# Altium schematic sheet Control.SchDoc: Motor Driver Control
size A4; SheetNumber: 4; SheetTotal: 4
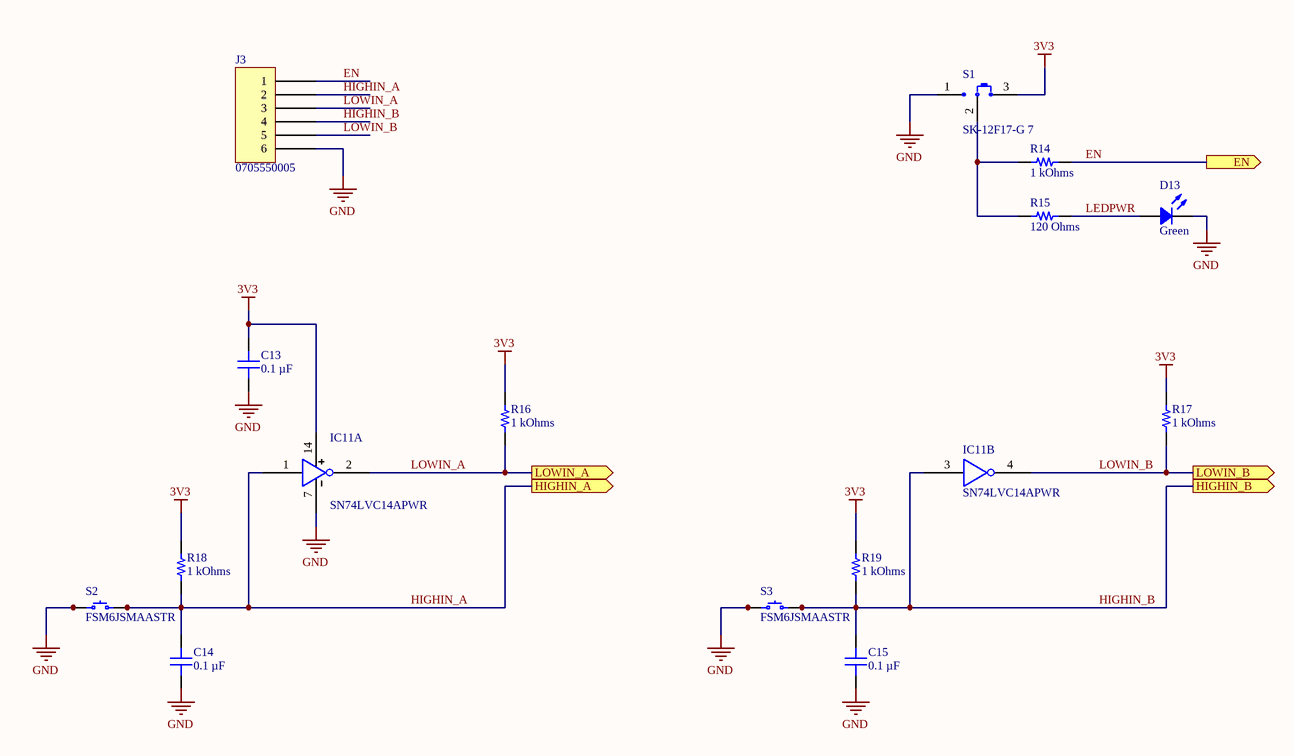
[diagram p0: Control.SchDoc]

## Parts
C13  0.1 µF  [CAP 0603_1608]
C14  0.1 µF  [CAP 0603_1608]
C15  0.1 µF  [CAP 0603_1608]
D13  Green  [LED 0603_1608 GREEN]
IC11  SN74LVC14APWR  [TI TSSOP-14 PW]  (parts A,B of 6)
J3  0705550005  [MOLEX SDA-70555-6PIN]
R14  1 kOhms  [RES 0603_1608]
R15  120 Ohms  [RES 0603_1608]
R16  1 kOhms  [RES 0603_1608]
R17  1 kOhms  [RES 0603_1608]
R18  1 kOhms  [RES 0603_1608]
R19  1 kOhms  [RES 0603_1608]
S1  SK-12F17-G 7  [C&K SK-12F17-G 7]
S2  FSM6JSMAASTR  [TE FSM6JSMA]
S3  FSM6JSMAASTR  [TE FSM6JSMA]

## Ports
EN (out), HIGHIN_A (out), HIGHIN_B (out), LOWIN_A (out), LOWIN_B (out)

## Nets
3V3: C13.2 IC11.14(VCC) R16.2 R17.2 R18.2 R19.2 S1.3
GND: C13.1 C14.1 C15.1 D13.2 IC11.7(GND) J3.6 S1.1 S2.1 S2.2 S3.1 S3.2
EN: J3.1 R14.2 ; port EN
HIGHIN_A: C14.2 IC11.1(1A) J3.2 R18.1 S2.3 S2.4 ; port HIGHIN_A
HIGHIN_B: C15.2 IC11.3(2A) J3.4 R19.1 S3.3 S3.4 ; port HIGHIN_B
LEDPWR: D13.1 R15.2
LOWIN_A: IC11.2(1Y) J3.3 R16.1 ; port LOWIN_A
LOWIN_B: IC11.4(2Y) J3.5 R17.1 ; port LOWIN_B
NetR14_1: R14.1 R15.1 S1.2(COM)

## Notes on the sheet
- Title
- Size:
- Date:
- A4
- Number:
- Time:
- Revision:
- Sheet
- of
- File:

## Library data of the parts
C13-C15 = C0603C104K8RAC7867: CAP CER 0.1UF 10V X7R 0603; manufacturer: KEMET; Tolerance: ±10%; Part Number: C0603C104K8RAC7867; Value: 0.1 µF; Applications: Bypass, Decoupling; Capacitance: 0.1 µF; componentlink1description: Datasheet; componentlink1url: https://api.kemet.com/component-edge/download/datasheet/C0603C104K8RACTU.pdf; componentlink2description: DigiKey Link; componentlink2url: https://www.digikey.com/en/products/detail/kemet/C0603C104K8RAC7867/411094; Device Package: 0603 (1608 Metric); lastupdated: 05/03/2022 16:47:38; Lifecycle Status: Active; Minimum Order: 1; Mounting Type: Surface Mount, MLCC; Operating Temperature: -55°C ~ 125°C; Package / Case: 0603 (1608 Metric); packaging: TapeAndReel; partid: 35650; Part Status: Active; price: 0.01; series: SMD Comm X7R; Size / Dimension: 0.063" L x 0.031" W (1.60mm x 0.80mm); Supplier 1: DigiKey; Supplier Part Number 1: 399-C0603C104K8RAC7867CT-ND; Temperature Coefficient: X7R; Thickness (Max): 0.034" (0.87mm); Voltage - Rated: 10V
D13 = XZMG53W-1: LED GREEN CLEAR CHIP SMD; Manufacturer: SunLED; Configuration: Standard; Current - Test: 20mA; Lens Color: Colorless; Lens Size: 1.10mm x 0.80mm; Lens Style: Rectangle with Flat Top; Millicandela Rating: 11mcd; Viewing Angle: 120°; Voltage - Forward (Vf) (Typ): 2.2V; Wavelength - Dominant: 568nm; Wavelength - Peak: 565nm; Part Number: XZMG53W-1; Color: Green; ComponentLink1Description: Datasheet; ComponentLink1URL: https://www.sunledusa.com/products/spec/XZMG53W-1.pdf; ComponentLink2Description: DigiKey Link; ComponentLink2URL: https://www.digikey.com/en/products/detail/sunled/XZMG53W-1/4745960; Device Package: 0603 (1608 Metric); Height (Max): 0.75mm; LastUpdated: 04/03/2022 18:10:12; Lens Transparency: Clear; Lifecycle Status: Active; Minimum Order: 1; Mounting Type: Surface Mount; Package / Case: 0603 (1608 Metric); Packaging: TapeAndReel; PartId: 678; Part Status: Active; Price: 0.04; Series: -; Size / Dimension: 1.60mm L x 0.80mm W; Supplier 1: DigiKey; Supplier Part Number 1: 1497-1186-1-ND; Supplier Device Package: Chip LED; Value: Green
IC11 = SN74LVC14APWR: IC INVERTER 6CH 6-INP 14TSSOP; Manufacturer: Texas Instruments; Current - Output High, Low: 24mA, 24mA; Current - Quiescent (Max): 1 µA; Logic Level - High: 1.3V ~ 2V; Logic Level - Low: 0.15V ~ 0.8V; Max Propagation Delay @ V, Max CL: 6.2ns @ 3.3V, 50pF; Number of Circuits: 6; Voltage - Supply: 1.65V ~ 3.6V; Part Number: SN74LVC14APWR; ComponentLink1Description: Datasheet; ComponentLink1URL: http://www.ti.com/general/docs/suppproductinfo.tsp?distId=10&gotoUrl=http%3A%2F%2Fwww.ti.com%2Flit%2Fgpn%2Fsn74lvc14a; ComponentLink2Description: DigiKey Link; ComponentLink2URL: https://www.digikey.com/en/products/detail/texas-instruments/SN74LVC14APWR/276867; Features: Schmitt Trigger; LastUpdated: 05/03/2022 19:21:42; Lifecycle Status: Active; Logic Type: Inverter; Minimum Order: 1; Mounting Type: Surface Mount; Number of Inputs: 6; Operating Temperature: -40°C ~ 125°C; Package / Case: 14-TSSOP (0.173", 4.40mm Width); Packaging: TapeAndReel; PartId: 14; Part Status: Active; Price: 0.11; Series: 74LVC; Supplier 1: DigiKey; Supplier Part Number 1: 296-1224-1-ND; Supplier Device Package: 14-TSSOP
J3 = 0705550005: CONN HEADER R/A 6POS 2.54MM; Manufacturer: Molex; Contact Length - Mating: 0.240" (6.10mm); Contact Length - Post: 0.130" (3.30mm); Material Flammability Rating: UL94 V-0; Number of Positions: 6; Number of Positions Loaded: All; Pitch - Mating: 0.100" (2.54mm); Shrouding: Shrouded - 4 Wall; Style: Board to Cable/Wire; Voltage Rating: 250V; Part Number: 0705550005; ComponentLink1Description: Datasheet; ComponentLink1URL: https://www.molex.com/pdm_docs/sd/705550001_sd.pdf; ComponentLink2Description: DigiKey Link; ComponentLink2URL: http://digikey.com/product-detail/en/molex/0705550005/23-0705550005-ND/1643402; Connector Type: Header; Contact Finish - Mating: Tin; Contact Finish - Post: Tin; Contact Finish Thickness - Mating: 150.0µin (3.81µm); Contact Material: Phosphor Bronze; Contact Shape: Square; Contact Type: Male Pin; Fastening Type: Latch Holder; Features: Board Guide; Insulation Color: Black; Insulation Height: 0.215" (5.45mm); Insulation Material: Polyester, Glass Filled; LastUpdated: 13/01/2020 00:04:40; Lifecycle Status: Active; Minimum Order: 1; Mounting Type: Through Hole, Right Angle; Number of Rows: 1; Operating Temperature: -40°C ~ 105°C; Packaging: Tube; PartId: 102; Part Status: Active; Price: 1.19; Series: SL 70555; Supplier 1: DigiKey; Supplier Part Number 1: 23-0705550005-ND; Termination: Solder
R14 R16-R19 = ERJ-PA3J102V: RES SMD 1K OHM 5% 1/4W 0603; Manufacturer: Panasonic Electronic Components; Power (Watts): 0.25W, 1/4W; Temperature Coefficient: ±200ppm/°C; Part Number: ERJ-PA3J102V; Value: 1 kOhms; ComponentLink1Description: Datasheet; ComponentLink1URL: https://industrial.panasonic.com/cdbs/www-data/pdf/RDO0000/AOA0000C331.pdf; ComponentLink2Description: DigiKey Link; ComponentLink2URL: https://www.digikey.com/en/products/detail/panasonic-electronic-components/ERJ-PA3J102V/5035970; Composition: Thick Film; Device Package: 0603 (1608 Metric); Features: Automotive AEC-Q200, Pulse Withstanding; Height - Seated (Max): 0.022" (0.55mm); LastUpdated: 05/03/2022 17:04:10; Lifecycle Status: Active; Minimum Order: 1; Number of Terminations: 2; Operating Temperature: -55°C ~ 155°C; Package / Case: 0603 (1608 Metric); Packaging: TapeAndReel; PartId: 17507; Part Status: Active; Price: 0.01; Ratings: AEC-Q200; Resistance: 1 kOhms; Series: ERJ-PA3; Size / Dimension: 0.063" L x 0.031" W (1.60mm x 0.80mm); Supplier 1: DigiKey; Supplier Part Number 1: P1KBZCT-ND; Supplier Device Package: 0603; Tolerance: ±5%
R15 = ERJ-PA3J121V: RES SMD 120 OHM 5% 1/4W 0603; Manufacturer: Panasonic Electronic Components; Power (Watts): 0.25W, 1/4W; Temperature Coefficient: ±200ppm/°C; Part Number: ERJ-PA3J121V; Value: 120 Ohms; ComponentLink1Description: Datasheet; ComponentLink1URL: https://industrial.panasonic.com/cdbs/www-data/pdf/RDO0000/AOA0000C331.pdf; ComponentLink2Description: DigiKey Link; ComponentLink2URL: https://www.digikey.com/en/products/detail/panasonic-electronic-components/ERJ-PA3J121V/5035980; Composition: Thick Film; Device Package: 0603 (1608 Metric); Features: Automotive AEC-Q200, Pulse Withstanding; Height - Seated (Max): 0.022" (0.55mm); LastUpdated: 05/03/2022 17:04:36; Lifecycle Status: Active; Minimum Order: 1; Number of Terminations: 2; Operating Temperature: -55°C ~ 155°C; Package / Case: 0603 (1608 Metric); Packaging: TapeAndReel; PartId: 8933; Part Status: Active; Price: 0.01; Ratings: AEC-Q200; Resistance: 120 Ohms; Series: ERJ-PA3; Size / Dimension: 0.063" L x 0.031" W (1.60mm x 0.80mm); Supplier 1: DigiKey; Supplier Part Number 1: P120BZCT-ND; Supplier Device Package: 0603; Tolerance: ±5%
S1 = SK-12F17-G 7: SWITCH SLIDE SPDT 300MA 30V; Manufacturer: C&K; Actuator Length: 7.00mm; Actuator Type: Standard; Contact Timing: Not Specified; Current Rating (Amps): 300mA (DC); Switch Function: On-On; Part Number: SK-12F17-G 7; Circuit: SPDT; ComponentLink1Description: Datasheet; ComponentLink1URL: //media.digikey.com/pdf/Data%20Sheets/C&K/SK-12F17-G.pdf; ComponentLink2Description: DigiKey Link; ComponentLink2URL: http://digikey.com/product-detail/en/c-k/SK-12F17-G-7/CKN10393-ND/2747163; Contact Finish: Silver; Contact Material: Copper; LastUpdated: 22/01/2022 09:16:27; Lifecycle Status: Active; Minimum Order: 1; Mounting Type: Through Hole, Right Angle; Packaging: Bulk; PartId: 3; Part Status: Active; Price: 0.55; Series: SK, COMAX; Supplier 1: DigiKey; Supplier Part Number 1: CKN10393-ND; Termination Style: PC Pin; Voltage Rating - DC: 30V
S2 S3 = FSM6JSMAASTR: SWITCH TACTILE SPST-NO 0.05A 24V; Manufacturer: TE Connectivity ALCOSWITCH Switches; Actuator Height off PCB, Vertical: 7.00mm; Actuator Orientation: Top Actuated; Actuator Type: Standard; Contact Rating @ Voltage: 0.05A @ 24VDC; Illumination: Non-Illuminated; Operating Force: 260gf; Outline: 6.00mm x 6.00mm; Switch Function: Off-Mom; Part Number: FSM6JSMAASTR; Circuit: SPST-NO; ComponentLink1Description: Datasheet; ComponentLink1URL: https://www.te.com/commerce/DocumentDelivery/DDEController?Action=srchrtrv&DocNm=1308111-1_SWITCHES_CORE_PROGRAM_CATALOG&DocType=CS&DocLang=English; ComponentLink2Description: DigiKey Link; ComponentLink2URL: https://www.digikey.com/en/products/detail/te-connectivity-alcoswitch-switches/FSM6JSMAASTR/5343804; LastUpdated: 05/03/2022 17:37:10; Lifecycle Status: Active; Minimum Order: 1; Mounting Type: Surface Mount; Operating Temperature: -40°C ~ 105°C; Packaging: TapeAndReel; Part Status: Active; Price: 0.30; Series: FSMJSMA; Supplier 1: DigiKey; Supplier Part Number 1: 450-2138-1-ND; Termination Style: Gull Wing